# Altium schematic sheet WiFi.SchDoc
size A4
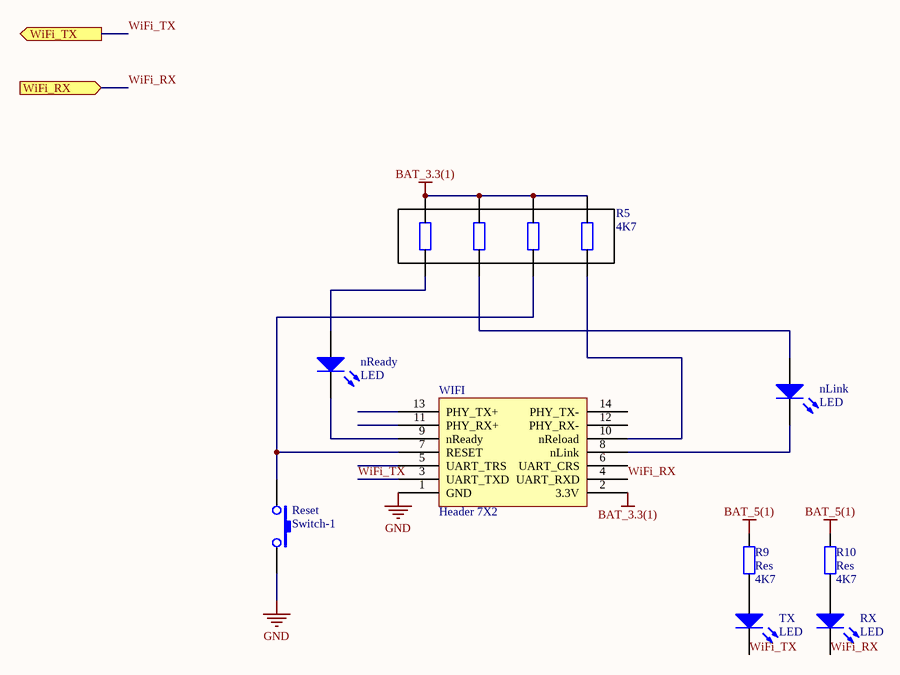
[diagram p0: WiFi.SchDoc]

## Parts
nLink  LED  [0805 2]
nReady  LED  [0805 2]
R5  value 4K7  [8P4R-0603]  (hidden comment: R x4)
R9  Res  value 4K7  [0805 2]
R10  Res  value 4K7  [0805 2]
Reset  Switch-1  [轻触按键]
RX  LED  [0805 2]
TX  LED  [0805 2]
WIFI  Header 7X2  [USR-WIFI232-X]

## Ports
WiFi_RX (in), WiFi_TX (out)

## Nets
BAT_3.3(1): R5.1 R5.3 R5.5 R5.7 WIFI.2(3.3V)
BAT_5(1): R9.2 R10.2
GND: Reset.2 WIFI.1(GND)
WiFi_RX: RX.2(K) WIFI.4(UART_RXD) ; port WiFi_RX
WiFi_TX: TX.2(K) WIFI.3(UART_TXD) ; port WiFi_TX
NetnLink_1: nLink.1(A) R5.4
NetnLink_2: nLink.2(K) WIFI.8(nLink)
NetnReady_1: nReady.1(A) R5.2
NetnReady_2: nReady.2(K) WIFI.9(nReady)
NetR5_6: R5.6 Reset.1 WIFI.7(RESET)
NetR5_8: R5.8 WIFI.10(nReload)
NetR9_1: R9.1 TX.1(A)
NetR10_1: R10.1 RX.1(A)

Not connected (* = marked no-connect by the designer): WIFI 5(UART_TRS) 6(UART_CRS) 11(PHY_RX+) 12(PHY_RX-) 13(PHY_TX+) 14(PHY_TX-)

## Library data of the parts
R5 = Res x4
R9 R10 = Res: Resistor; Published: 8-Jun-2000; LatestRevisionDate: 17-Jul-2002; LatestRevisionNote: Re-released for DXP Platform.; PackageReference: AXIAL-0.4; Publisher: Altium Limited; PackageDescription: Axial Device, Thru-Hole; 2 Leads; 0.4 in Pin Spacing
WIFI = USR-WIFI232-X